# Altium schematic sheet TypeA_3.1_Ports.SchDoc
size A3; SheetNumber: 1; SheetTotal: 4
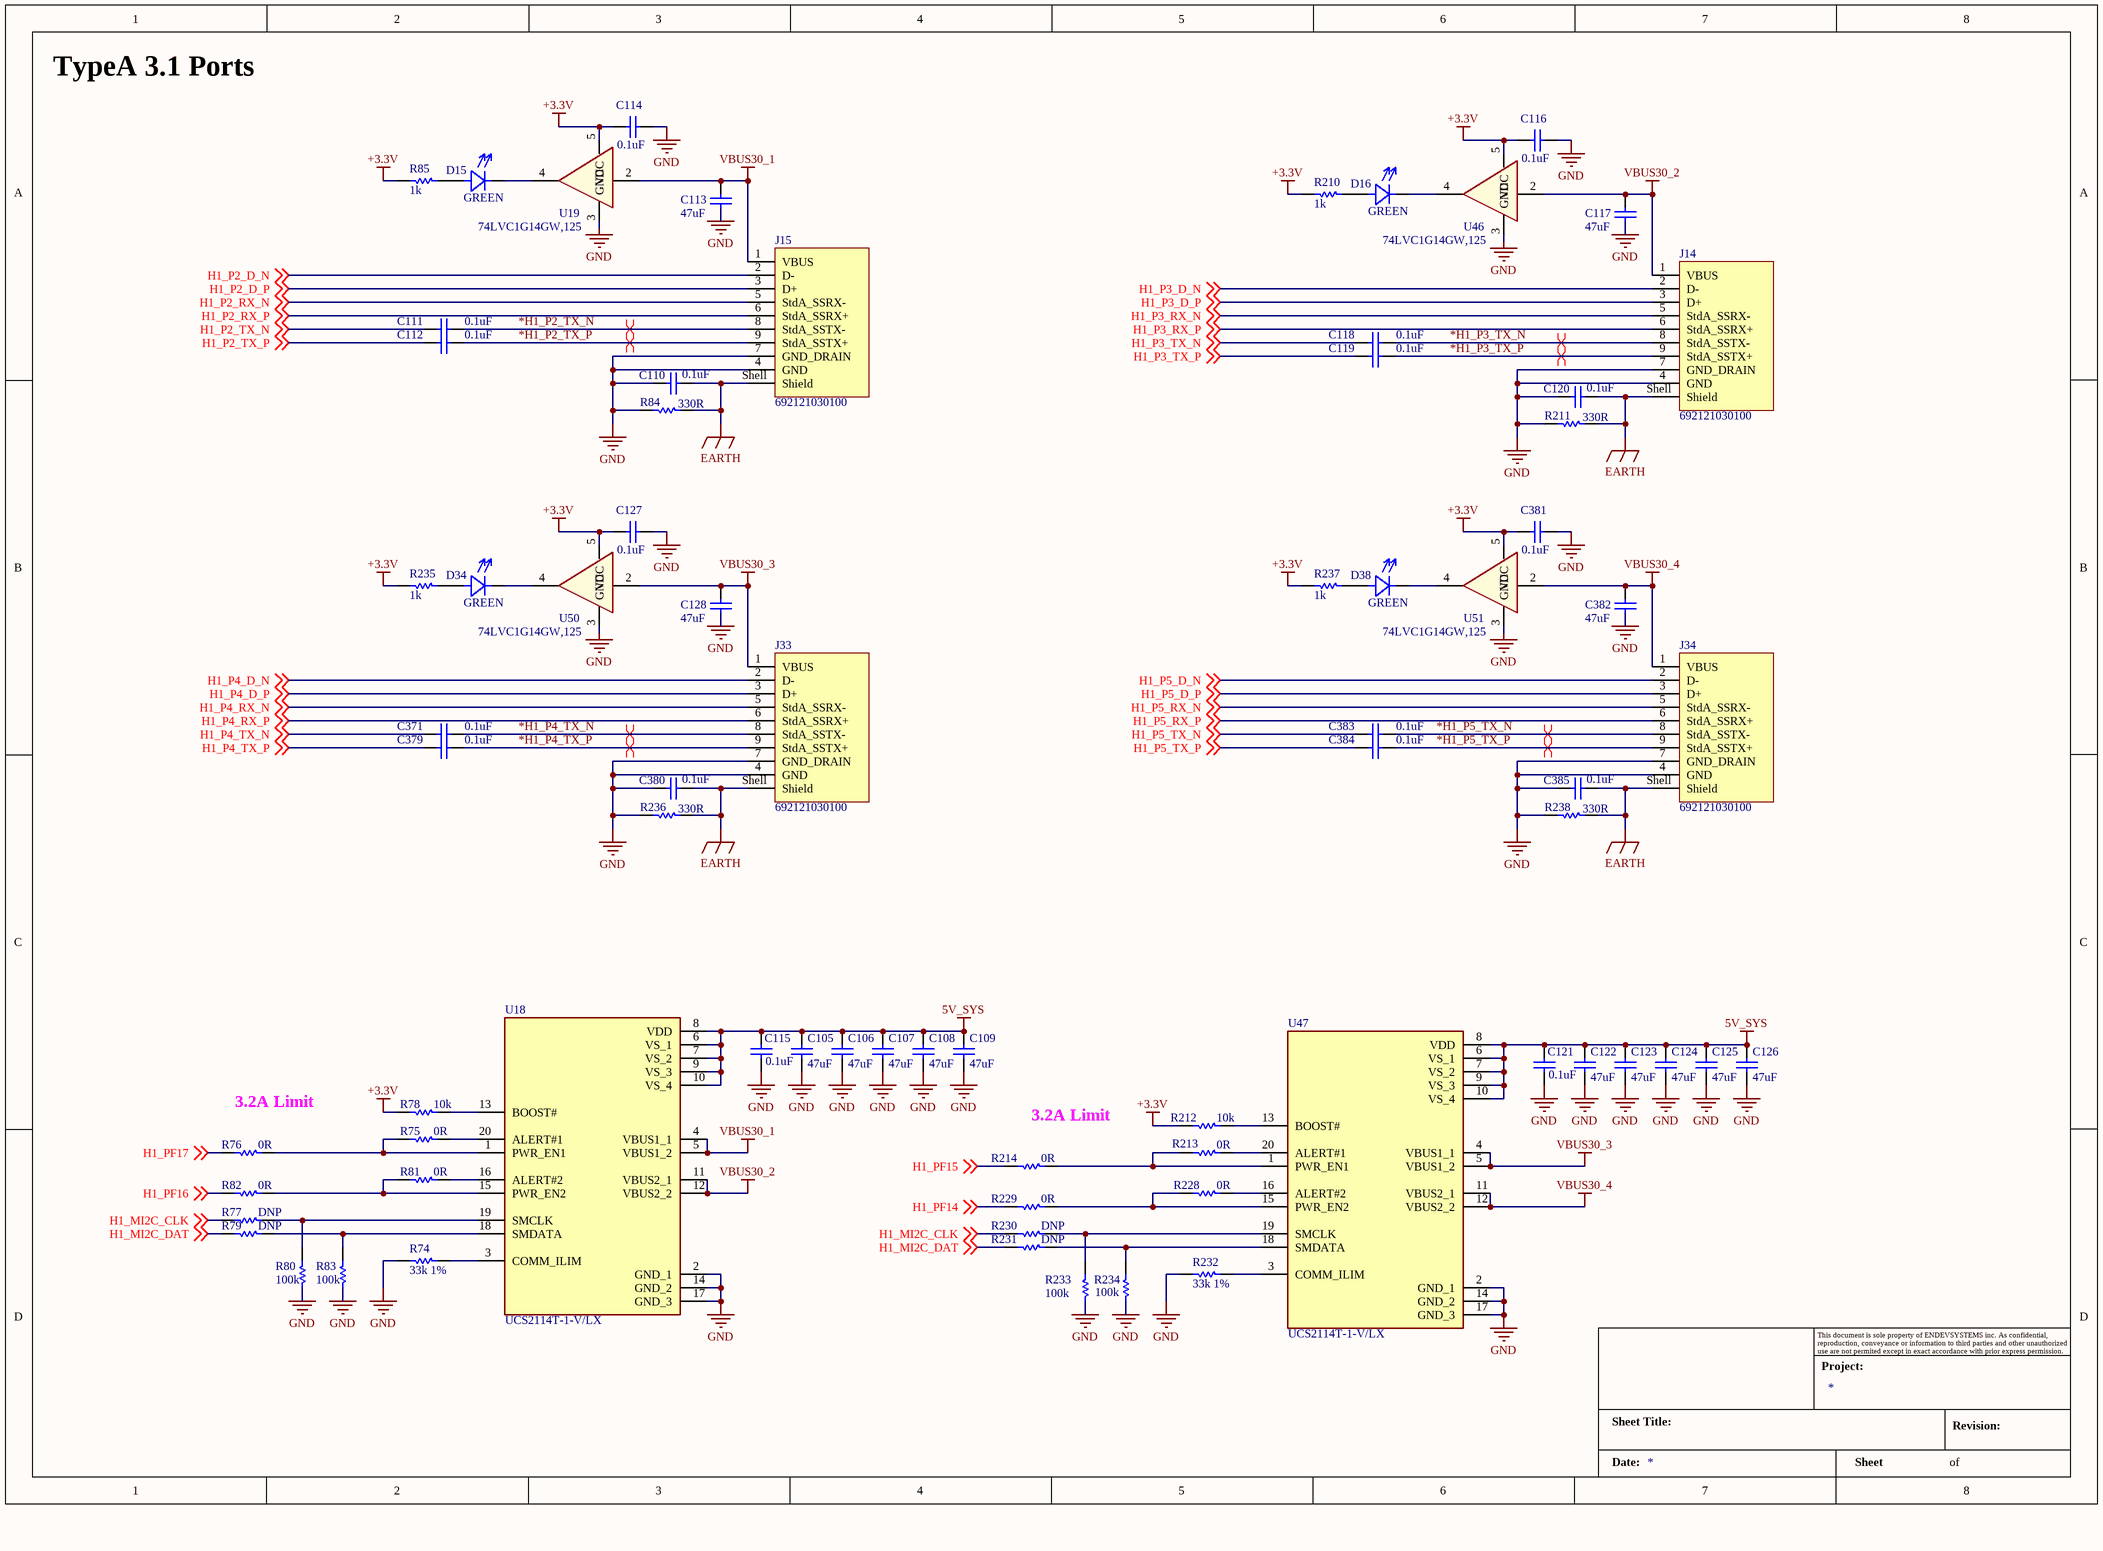
[diagram p0: TypeA_3.1_Ports.SchDoc]

## Parts
?  Title_Block  (value not drawn)  (graphical)
C105  value 47uF  [C-0402/1005]  (hidden comment: 0.1uF)
C106  value 47uF  [C-0402/1005]  (hidden comment: 0.1uF)
C107  value 47uF  [C-0402/1005]  (hidden comment: 0.1uF)
C108  value 47uF  [C-0402/1005]  (hidden comment: 0.1uF)
C109  value 47uF  [C-0402/1005]  (hidden comment: 0.1uF)
C110  0.1uF  [C-0603/1608]
C111  0.1uF  [C-0402/1005]
C112  0.1uF  [C-0402/1005]
C113  47uF  [C-0805/2012]
C114  0.1uF  [C-0402/1005]
C115  0.1uF  [C-0402/1005]
C116  0.1uF  [C-0402/1005]
C117  47uF  [C-0805/2012]
C118  0.1uF  [C-0402/1005]
C119  0.1uF  [C-0402/1005]
C120  0.1uF  [C-0603/1608]
C121  0.1uF  [C-0402/1005]
C122  value 47uF  [C-0402/1005]  (hidden comment: 0.1uF)
C123  value 47uF  [C-0402/1005]  (hidden comment: 0.1uF)
C124  value 47uF  [C-0402/1005]  (hidden comment: 0.1uF)
C125  value 47uF  [C-0402/1005]  (hidden comment: 0.1uF)
C126  value 47uF  [C-0402/1005]  (hidden comment: 0.1uF)
C127  0.1uF  [C-0402/1005]
C128  47uF  [C-0805/2012]
C371  0.1uF  [C-0402/1005]
C379  0.1uF  [C-0402/1005]
C380  0.1uF  [C-0603/1608]
C381  0.1uF  [C-0402/1005]
C382  47uF  [C-0805/2012]
C383  0.1uF  [C-0402/1005]
C384  0.1uF  [C-0402/1005]
C385  0.1uF  [C-0603/1608]
D15  GREEN  [LEDC1608X65N]
D16  GREEN  [LEDC1608X65N]
D34  GREEN  [LEDC1608X65N]
D38  GREEN  [LEDC1608X65N]
J14  692121030100  [692121030100]
J15  692121030100  [692121030100]
J33  692121030100  [692121030100]
J34  692121030100  [692121030100]
R74  33k 1%  [R-0402/1005]
R75  0R  [R-0402/1005]
R76  0R  [R-0402/1005]
R77  DNP  [R-0402/1005]
R78  10k  [R-0402/1005]
R79  DNP  [R-0402/1005]
R80  100k  [R-0402/1005]
R81  0R  [R-0402/1005]
R82  0R  [R-0402/1005]
R83  100k  [R-0402/1005]
R84  330R  [R-0603/1608]
R85  1k  [R-0402/1005]
R210  1k  [R-0402/1005]
R211  330R  [R-0603/1608]
R212  10k  [R-0402/1005]
R213  0R  [R-0402/1005]
R214  0R  [R-0402/1005]
R228  0R  [R-0402/1005]
R229  0R  [R-0402/1005]
R230  DNP  [R-0402/1005]
R231  DNP  [R-0402/1005]
R232  33k 1%  [R-0402/1005]
R233  100k  [R-0402/1005]
R234  100k  [R-0402/1005]
R235  1k  [R-0402/1005]
R236  330R  [R-0603/1608]
R237  1k  [R-0402/1005]
R238  330R  [R-0603/1608]
U18  UCS2114T-1-V/LX  [QFN50P300X300X90-20N-D]
U19  74LVC1G14GW,125  [SOT65P212X110-5N]
U46  74LVC1G14GW,125  [SOT65P212X110-5N]
U47  UCS2114T-1-V/LX  [QFN50P300X300X90-20N-D]
U50  74LVC1G14GW,125  [SOT65P212X110-5N]
U51  74LVC1G14GW,125  [SOT65P212X110-5N]

## Nets
5V_SYS: C105.2 C106.2 C107.2 C108.2 C109.2 C115.2 C121.2 C122.2 C123.2 C124.2 C125.2 C126.2 U18.6(VS_1) U18.7(VS_2) U18.8(VDD) U18.9(VS_3) U18.10(VS_4) U47.6(VS_1) U47.7(VS_2) U47.8(VDD) U47.9(VS_3) U47.10(VS_4)
+3.3V: C114.2 C116.2 C127.2 C381.2 R78.1 R85.2 R210.2 R212.1 R235.2 R237.2 U19.5(VCC) U46.5(VCC) U50.5(VCC) U51.5(VCC)
EARTH: C110.1 C120.1 C380.1 C385.1 J14.Shell(Shield) J15.Shell(Shield) J33.Shell(Shield) J34.Shell(Shield) R84.1 R211.1 R236.1 R238.1
GND: C105.1 C106.1 C107.1 C108.1 C109.1 C110.2 C113.1 C114.1 C115.1 C116.1 C117.1 C120.2 C121.1 C122.1 C123.1 C124.1 C125.1 C126.1 C127.1 C128.1 C380.2 C381.1 C382.1 C385.2 J14.4(GND) J14.7(GND_DRAIN) J15.4(GND) J15.7(GND_DRAIN) J33.4(GND) J33.7(GND_DRAIN) J34.4(GND) J34.7(GND_DRAIN) R74.1 R80.1 R83.1 R84.2 R211.2 R232.1 R233.1 R234.1 R236.2 R238.2 U18.2(GND_1) U18.14(GND_2) U18.17(GND_3) U19.3(GND) U46.3(GND) U47.2(GND_1) U47.14(GND_2) U47.17(GND_3) U50.3(GND) U51.3(GND)
VBUS30_1: C113.2 J15.1(VBUS) U18.4(VBUS1_1) U18.5(VBUS1_2) U19.2(A)
VBUS30_2: C117.2 J14.1(VBUS) U18.11(VBUS2_1) U18.12(VBUS2_2) U46.2(A)
VBUS30_3: C128.2 J33.1(VBUS) U47.4(VBUS1_1) U47.5(VBUS1_2) U50.2(A)
VBUS30_4: C382.2 J34.1(VBUS) U47.11(VBUS2_1) U47.12(VBUS2_2) U51.2(A)
*H1_P2_TX_N: C111.1 J15.8(StdA_SSTX-)
*H1_P2_TX_P: C112.1 J15.9(StdA_SSTX+)
*H1_P3_TX_N: C118.1 J14.8(StdA_SSTX-)
*H1_P3_TX_P: C119.1 J14.9(StdA_SSTX+)
*H1_P4_TX_N: C371.1 J33.8(StdA_SSTX-)
*H1_P4_TX_P: C379.1 J33.9(StdA_SSTX+)
*H1_P5_TX_N: C383.1 J34.8(StdA_SSTX-)
*H1_P5_TX_P: C384.1 J34.9(StdA_SSTX+)
H1_MI2C_CLK: R77.1 R230.1 ; off-sheet H1_MI2C_CLK
H1_MI2C_DAT: R79.1 R231.1 ; off-sheet H1_MI2C_DAT
H1_P2_D_N: J15.2(D-) ; off-sheet H1_P2_D_N
H1_P2_D_P: J15.3(D+) ; off-sheet H1_P2_D_P
H1_P2_RX_N: J15.5(StdA_SSRX-) ; off-sheet H1_P2_RX_N
H1_P2_RX_P: J15.6(StdA_SSRX+) ; off-sheet H1_P2_RX_P
H1_P2_TX_N: C111.2 ; off-sheet H1_P2_TX_N
H1_P2_TX_P: C112.2 ; off-sheet H1_P2_TX_P
H1_P3_D_N: J14.2(D-) ; off-sheet H1_P3_D_N
H1_P3_D_P: J14.3(D+) ; off-sheet H1_P3_D_P
H1_P3_RX_N: J14.5(StdA_SSRX-) ; off-sheet H1_P3_RX_N
H1_P3_RX_P: J14.6(StdA_SSRX+) ; off-sheet H1_P3_RX_P
H1_P3_TX_N: C118.2 ; off-sheet H1_P3_TX_N
H1_P3_TX_P: C119.2 ; off-sheet H1_P3_TX_P
H1_P4_D_N: J33.2(D-) ; off-sheet H1_P4_D_N
H1_P4_D_P: J33.3(D+) ; off-sheet H1_P4_D_P
H1_P4_RX_N: J33.5(StdA_SSRX-) ; off-sheet H1_P4_RX_N
H1_P4_RX_P: J33.6(StdA_SSRX+) ; off-sheet H1_P4_RX_P
H1_P4_TX_N: C371.2 ; off-sheet H1_P4_TX_N
H1_P4_TX_P: C379.2 ; off-sheet H1_P4_TX_P
H1_P5_D_N: J34.2(D-) ; off-sheet H1_P5_D_N
H1_P5_D_P: J34.3(D+) ; off-sheet H1_P5_D_P
H1_P5_RX_N: J34.5(StdA_SSRX-) ; off-sheet H1_P5_RX_N
H1_P5_RX_P: J34.6(StdA_SSRX+) ; off-sheet H1_P5_RX_P
H1_P5_TX_N: C383.2 ; off-sheet H1_P5_TX_N
H1_P5_TX_P: C384.2 ; off-sheet H1_P5_TX_P
H1_PF14: R229.1 ; off-sheet H1_PF14
H1_PF15: R214.1 ; off-sheet H1_PF15
H1_PF16: R82.1 ; off-sheet H1_PF16
H1_PF17: R76.1 ; off-sheet H1_PF17
NetD15_A: D15.A R85.1
NetD15_C: D15.C U19.4(~{Y})
NetD16_A: D16.A R210.1
NetD16_C: D16.C U46.4(~{Y})
NetD34_A: D34.A R235.1
NetD34_C: D34.C U50.4(~{Y})
NetD38_A: D38.A R237.1
NetD38_C: D38.C U51.4(~{Y})
NetR74_2: R74.2 U18.3(COMM_ILIM)
NetR75_1: R75.1 R76.2 U18.1(PWR_EN1)
NetR75_2: R75.2 U18.20(ALERT#1)
NetR77_2: R77.2 R80.2 U18.19(SMCLK)
NetR78_2: R78.2 U18.13(BOOST#)
NetR79_2: R79.2 R83.2 U18.18(SMDATA)
NetR81_1: R81.1 R82.2 U18.15(PWR_EN2)
NetR81_2: R81.2 U18.16(ALERT#2)
NetR212_2: R212.2 U47.13(BOOST#)
NetR213_1: R213.1 R214.2 U47.1(PWR_EN1)
NetR213_2: R213.2 U47.20(ALERT#1)
NetR228_1: R228.1 R229.2 U47.15(PWR_EN2)
NetR228_2: R228.2 U47.16(ALERT#2)
NetR230_2: R230.2 R233.2 U47.19(SMCLK)
NetR231_2: R231.2 R234.2 U47.18(SMDATA)
NetR232_2: R232.2 U47.3(COMM_ILIM)

## Layout directives
differential pair; differential pair class Diff_90R: *H1_P2_TX_N, *H1_P2_TX_P, *H1_P3_TX_N, *H1_P3_TX_P, *H1_P4_TX_N, *H1_P4_TX_P, *H1_P5_TX_N, *H1_P5_TX_P

## Notes on the sheet
- TypeA 3.1 Ports
- (near R76) 3.2A Limit
- (near R214) 3.2A Limit
- (in symbol Title_Block) This document is sole property of ENDEVSYSTEMS inc. As confidential, reproduction, conveyance or information to third parties and other unauthorized use are not permited except in exact accordance with prior express permission.; Project:; Sheet Title:; Revision:; Date:; Sheet; of

## Library data of the parts
C105-C112 C114-C116 C118-C127 C371 C379-C381 C383-C385 = Cap: Capacitor; Published: 8-Jun-2000; LatestRevisionDate: 17-Jul-2002; LatestRevisionNote: Re-released for DXP Platform.; PackageReference: RAD-0.3; Publisher: Altium Limited; PackageDescription: Radial Cap, Thru-Hole; 2 Leads; 0.3 in Pin Spacing
  C110-C112 C114-C116 C118-C121 C127 C371 C379-C381 C383-C385: Value: 0.1uF
C113 C117 C128 C382 = Cap: Capacitor; Value: 0.1uF; Published: 8-Jun-2000; LatestRevisionDate: 17-Jul-2002; LatestRevisionNote: Re-released for DXP Platform.; PackageReference: RAD-0.3; Publisher: Altium Limited; PackageDescription: Radial Cap, Thru-Hole; 2 Leads; 0.3 in Pin Spacing
D15 D16 D34 D38 = Diode-LED: Supplier: Digikey Electronics
J14 J15 J33 J34 = CMP-1502-03216-3: NexarPartId: 19667814; Voltage Rating: 30V; Current Rating: 1.8A; Contact Resistance: 50mΩ; Number of Ports: 1; Connector Type: USB; Gender: Receptacle; USB Standard: USB 3.0; Insulation Resistance: 100MΩ; Number of Contacts: 9; RoHS: Compliant; Voltage Rating (AC): 30V; Min Operating Temperature: -20°C; Contact Material: Bronze, Gold, Nickel; Features: Shielded; Color: Blue; Termination: Through Hole; Mount: Horizontal, Through Hole; Length: 15.48mm; Max Operating Temperature: 85°C; Packaging: Tape and Reel; Flammability Rating: UL94 V-0; Lead Free: Lead Free; REACH SVHC: Unknown; Number of Pins: 9; Contact Plating: Gold; Width: 16.48mm; Height: 7.87mm; Operating Supply Voltage: 30V; Orientation: Horizontal
R74-R77 R79-R85 R210 R211 R213 R214 R228-R238 = Res1: Resistor; Value: 10K; Published: 8-Jun-2000; LatestRevisionDate: 17-Jul-2002; LatestRevisionNote: Re-released for DXP Platform.; PackageReference: AXIAL-0.3; Publisher: Altium Limited; PackageDescription: Axial Device, Thru-Hole; 2 Leads; 0.3 in Pin Spacing
R78 R212 = Res1: Resistor; Published: 8-Jun-2000; LatestRevisionDate: 17-Jul-2002; LatestRevisionNote: Re-released for DXP Platform.; PackageReference: AXIAL-0.3; Publisher: Altium Limited; PackageDescription: Axial Device, Thru-Hole; 2 Leads; 0.3 in Pin Spacing; Value: 10K
U18 U47 = UCS2114T-1-V_LX: Integrated Circuit; Manufacturer_Name: Microchip; Datasheet Link: https://www.mouser.in/datasheet/2/268/UCS2114_Data_Sheet_20005743B-2900672.pdf; Height: 0.9mm; Manufacturer_Part_Number: UCS2114T-1-V/LX; Mouser Part Number: 579-UCS2114T-1-V/LX; Mouser Price/Stock: https://www.mouser.co.uk/ProductDetail/Microchip-Technology/UCS2114T-1-V-LX?qs=Mv7BduZupUg9QQFwmxWMcA%3D%3D; Arrow Part Number: UCS2114T-1-V/LX; Arrow Price/Stock: https://www.arrow.com/en/products/ucs2114t-1-vlx/microchip-technology?region=nac
U19 U46 U50 U51 = 74LVC1G14GW,125: Inverter Schmitt Trigger 1-Element CMOS 5-Pin TSSOP T/R; Price: None; Availability: Unavailable; MP: 74LVC1G14GW,125; Value: *; Package: None
? = Title_Block: Date:: *; Project:: *